# EAGLE design quantizer2_v50 (EAGLE 9.6.2)

## Sheet 1 of 2
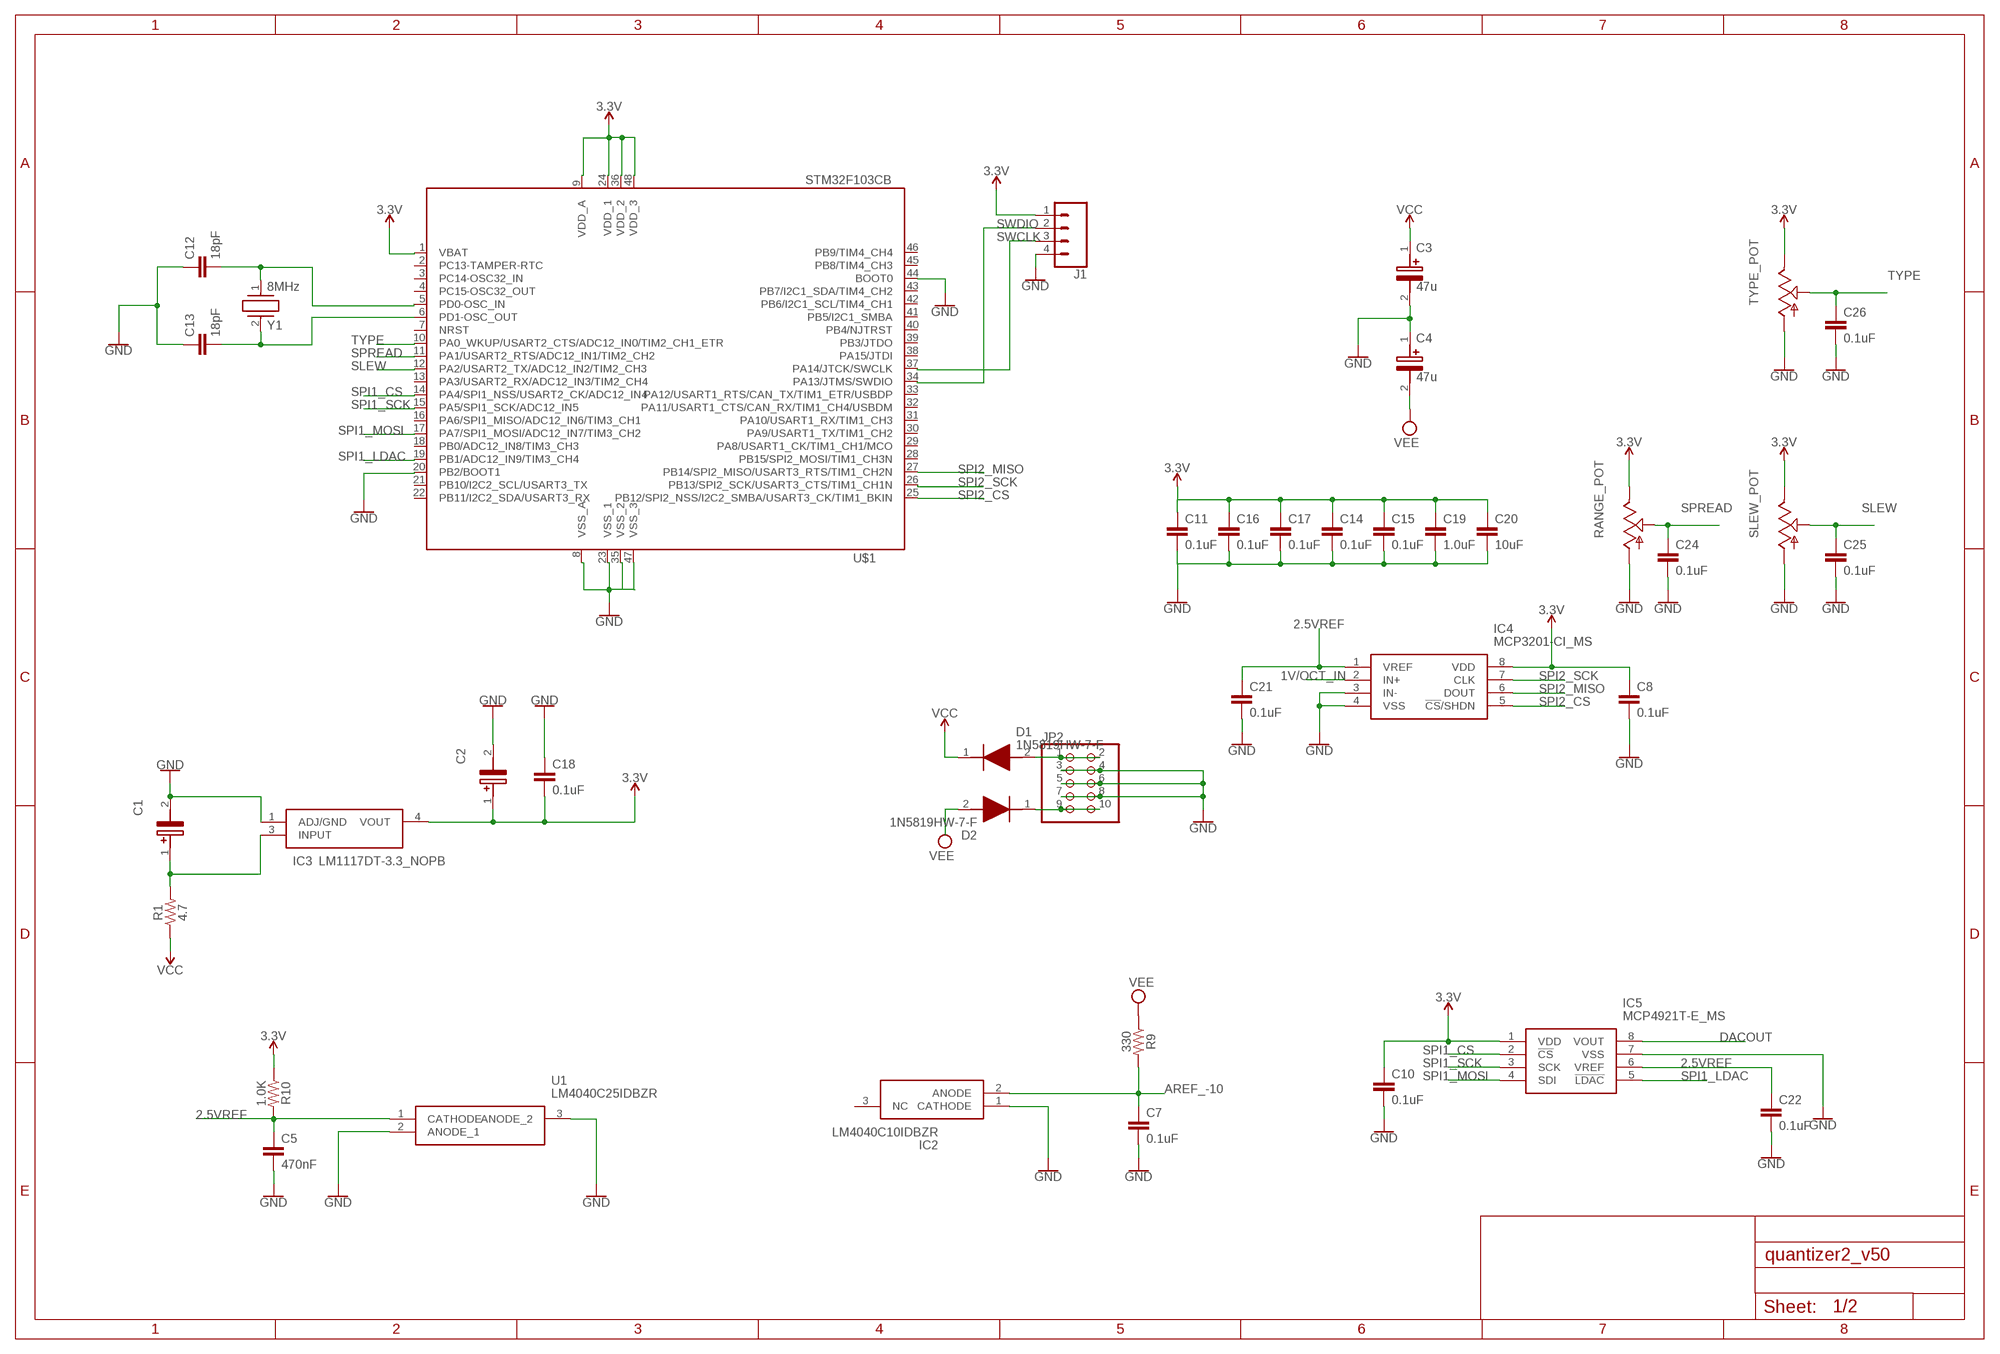
[diagram p0: schematic, sheet 1]

### Parts
C1  22uF  EEE-FP1E220AR  [EEE0GA101SR]
C2  22uF  EEE-FP1E220AR  [EEE0GA101SR]
C3  47u  EEE-FK1V470P  [EEE1AA101SP]
C4  47u  EEE-FK1V470P  [EEE1AA101SP]
C5  470nF  0.1UF-0603-25V-(+80/-20%)  [0603]
C7  0.1uF  0.1UF-0603-25V-(+80/-20%)  [0603]
C8  0.1uF  0.1UF-0603-25V-5%  [0603]
C10  0.1uF  0.1UF-0603-25V-5%  [0603]
C11  0.1uF  0.1UF-0603-25V-5%  [0603]
C12  18pF  18PF-0603-50V-5%  [0603]
C13  18pF  18PF-0603-50V-5%  [0603]
C14  0.1uF  0.1UF-0603-25V-5%  [0603]
C15  0.1uF  0.1UF-0603-25V-5%  [0603]
C16  0.1uF  0.1UF-0603-25V-(+80/-20%)  [0603]
C17  0.1uF  0.1UF-0603-25V-(+80/-20%)  [0603]
C18  0.1uF  0.1UF-0603-25V-(+80/-20%)  [0603]
C19  1.0uF  1.0UF-0603-16V-10%  [0603]
C20  10uF  10UF-0603-6.3V-20%  [0603]
C21  0.1uF  0.1UF-0603-25V-5%  [0603]
C22  0.1uF  0.1UF-0603-25V-5%  [0603]
C24  0.1uF  0.1UF-0603-25V-(+80/-20%)  [0603]
C25  0.1uF  0.1UF-0603-25V-(+80/-20%)  [0603]
C26  0.1uF  0.1UF-0603-25V-(+80/-20%)  [0603]
D1  1N5819HW-7-F  [SOD3716X145N]
D2  1N5819HW-7-F  [SOD3716X145N]
IC2  LM4040C10IDBZR  [SOT95P237X112-3N]
IC3  LM1117DT-3.3_NOPB  [TO228P991X238-3N]
IC4  MCP3201-CI_MS  [SOP65P490X110-8N]
IC5  MCP4921T-E_MS  [SOP65P490X110-8N]
J1  CONN_04  [1X04]
JP2  PINHD-2X5  [2X05]
R1  4.7  RESISTOR1206  [1206]
R9  330  RESISTOR0603  [0603]
R10  1.0K  RESISTOR0603  [0603]
RANGE_POT  POT_USVERTICAL_PS  [ALPS_POT_VERTICAL_PS]
SLEW_POT  POTENTIOMETER-ALPHA-9MM_VERTICAL_  [POTENTIOMETER-ALPHA-9MM_VERTICAL]
TYPE_POT  POT_USVERTICAL_PS  [ALPS_POT_VERTICAL_PS]
U1  LM4040C25IDBZR  [SOT95P237X112-3N]
U$1  STM32F103CB  [LQFP48]
Y1  8MHz  ABLS3-8.000MHZ-D4Y-T  [ABLS]

### Nets
1V/OCT_IN: IC4.2(IN+) ; also sheet 2
2.5VREF: C5.1 C21.1 C22.1 IC4.1(VREF) IC5.6(VREF) R10.2 U1.1(CATHODE)
3.3V: C2.1(+) C8.1 C10.1 C11.1 C14.1 C15.1 C16.1 C17.1 C18.2 C19.1 C20.1 IC3.4(VOUT) IC4.8(VDD) IC5.1(VDD) J1.1 R10.1 RANGE_POT.P$1(E) SLEW_POT.3(E) TYPE_POT.P$1(E) U$1.1(VBAT) U$1.9(VDD_A) U$1.24(VDD_1) U$1.36(VDD_2) U$1.48(VDD_3)
AREF_-10: C7.1 IC2.2(ANODE) R9.2 ; also sheet 2
DACOUT: IC5.8(VOUT) ; also sheet 2
GND: C1.2(-) C2.2(-) C3.2(-) C4.1(+) C5.2 C7.2 C8.2 C10.2 C12.1 C13.1 C18.1 C21.2 C22.2 C24.2 C25.2 C26.2 IC2.1(CATHODE) IC3.1(ADJ/GND) IC4.3(IN-) IC4.4(VSS) IC5.7(VSS) J1.4 JP2.3 JP2.4 JP2.5 JP2.6 JP2.7 JP2.8 RANGE_POT.P$3(A) SLEW_POT.1(A) TYPE_POT.P$3(A) U1.2(ANODE_1) U1.3(ANODE_2) U$1.8(VSS_A) U$1.20(PB2/BOOT1) U$1.23(VSS_1) U$1.35(VSS_2) U$1.44(BOOT0) U$1.47(VSS_3) ; also sheet 2
N$2: C1.1(+) IC3.3(INPUT) R1.2
N$4: D1.2(A) JP2.1 JP2.2
N$6: D2.1(K) JP2.9 JP2.10
N$10: C12.2 U$1.5(PD0-OSC_IN) Y1.1
N$11: C13.2 U$1.6(PD1-OSC_OUT) Y1.2
N$12: C11.2 C14.2 C15.2 C16.2 C17.2 C19.2 C20.2 ; supply symbol labelled GND
SLEW: C25.1 SLEW_POT.2(S) U$1.12(PA2/USART2_TX/ADC12_IN2/TIM2_CH3)
SPI1_CS: IC5.2(!CS) U$1.14(PA4/SPI1_NSS/USART2_CK/ADC12_IN4)
SPI1_LDAC: IC5.5(!LDAC) U$1.19(PB1/ADC12_IN9/TIM3_CH4)
SPI1_MOSI: IC5.4(SDI) U$1.17(PA7/SPI1_MOSI/ADC12_IN7/TIM3_CH2)
SPI1_SCK: IC5.3(SCK) U$1.15(PA5/SPI1_SCK/ADC12_IN5)
SPI2_CS: IC4.5(!CS!/SHDN) U$1.25(PB12/SPI2_NSS/I2C2_SMBA/USART3_CK/TIM1_BKIN)
SPI2_MISO: IC4.6(DOUT) U$1.27(PB14/SPI2_MISO/USART3_RTS/TIM1_CH2N)
SPI2_SCK: IC4.7(CLK) U$1.26(PB13/SPI2_SCK/USART3_CTS/TIM1_CH1N)
SPREAD: C24.1 RANGE_POT.P$2(S) U$1.11(PA1/USART2_RTS/ADC12_IN1/TIM2_CH2)
SWCLK: J1.3 U$1.37(PA14/JTCK/SWCLK)
SWDIO: J1.2 U$1.34(PA13/JTMS/SWDIO)
TYPE: C26.1 TYPE_POT.P$2(S) U$1.10(PA0_WKUP/USART2_CTS/ADC12_IN0/TIM2_CH1_ETR)
VCC: C3.1(+) D1.1(K) R1.1 ; also sheet 2
VEE: C4.2(-) D2.2(A) R9.1 ; also sheet 2
Unconnected: IC2.3(NC) U$1.2(PC13-TAMPER-RTC) U$1.3(PC14-OSC32_IN) U$1.4(PC15-OSC32_OUT) U$1.7(NRST) U$1.13(PA3/USART2_RX/ADC12_IN3/TIM2_CH4) U$1.16(PA6/SPI1_MISO/ADC12_IN6/TIM3_CH1) U$1.18(PB0/ADC12_IN8/TIM3_CH3) U$1.21(PB10/I2C2_SCL/USART3_TX) U$1.22(PB11/I2C2_SDA/USART3_RX) U$1.28(PB15/SPI2_MOSI/TIM1_CH3N) U$1.29(PA8/USART1_CK/TIM1_CH1/MCO) U$1.30(PA9/USART1_TX/TIM1_CH2) U$1.31(PA10/USART1_RX/TIM1_CH3) U$1.32(PA11/USART1_CTS/CAN_RX/TIM1_CH4/USBDM) U$1.33(PA12/USART1_RTS/CAN_TX/TIM1_ETR/USBDP) U$1.38(PA15/JTDI) U$1.39(PB3/JTDO) U$1.40(PB4/NJTRST) U$1.41(PB5/I2C1_SMBA) U$1.42(PB6/I2C1_SCL/TIM4_CH1) U$1.43(PB7/I2C1_SDA/TIM4_CH2) U$1.45(PB8/TIM4_CH3) U$1.46(PB9/TIM4_CH4)

## Sheet 2 of 2
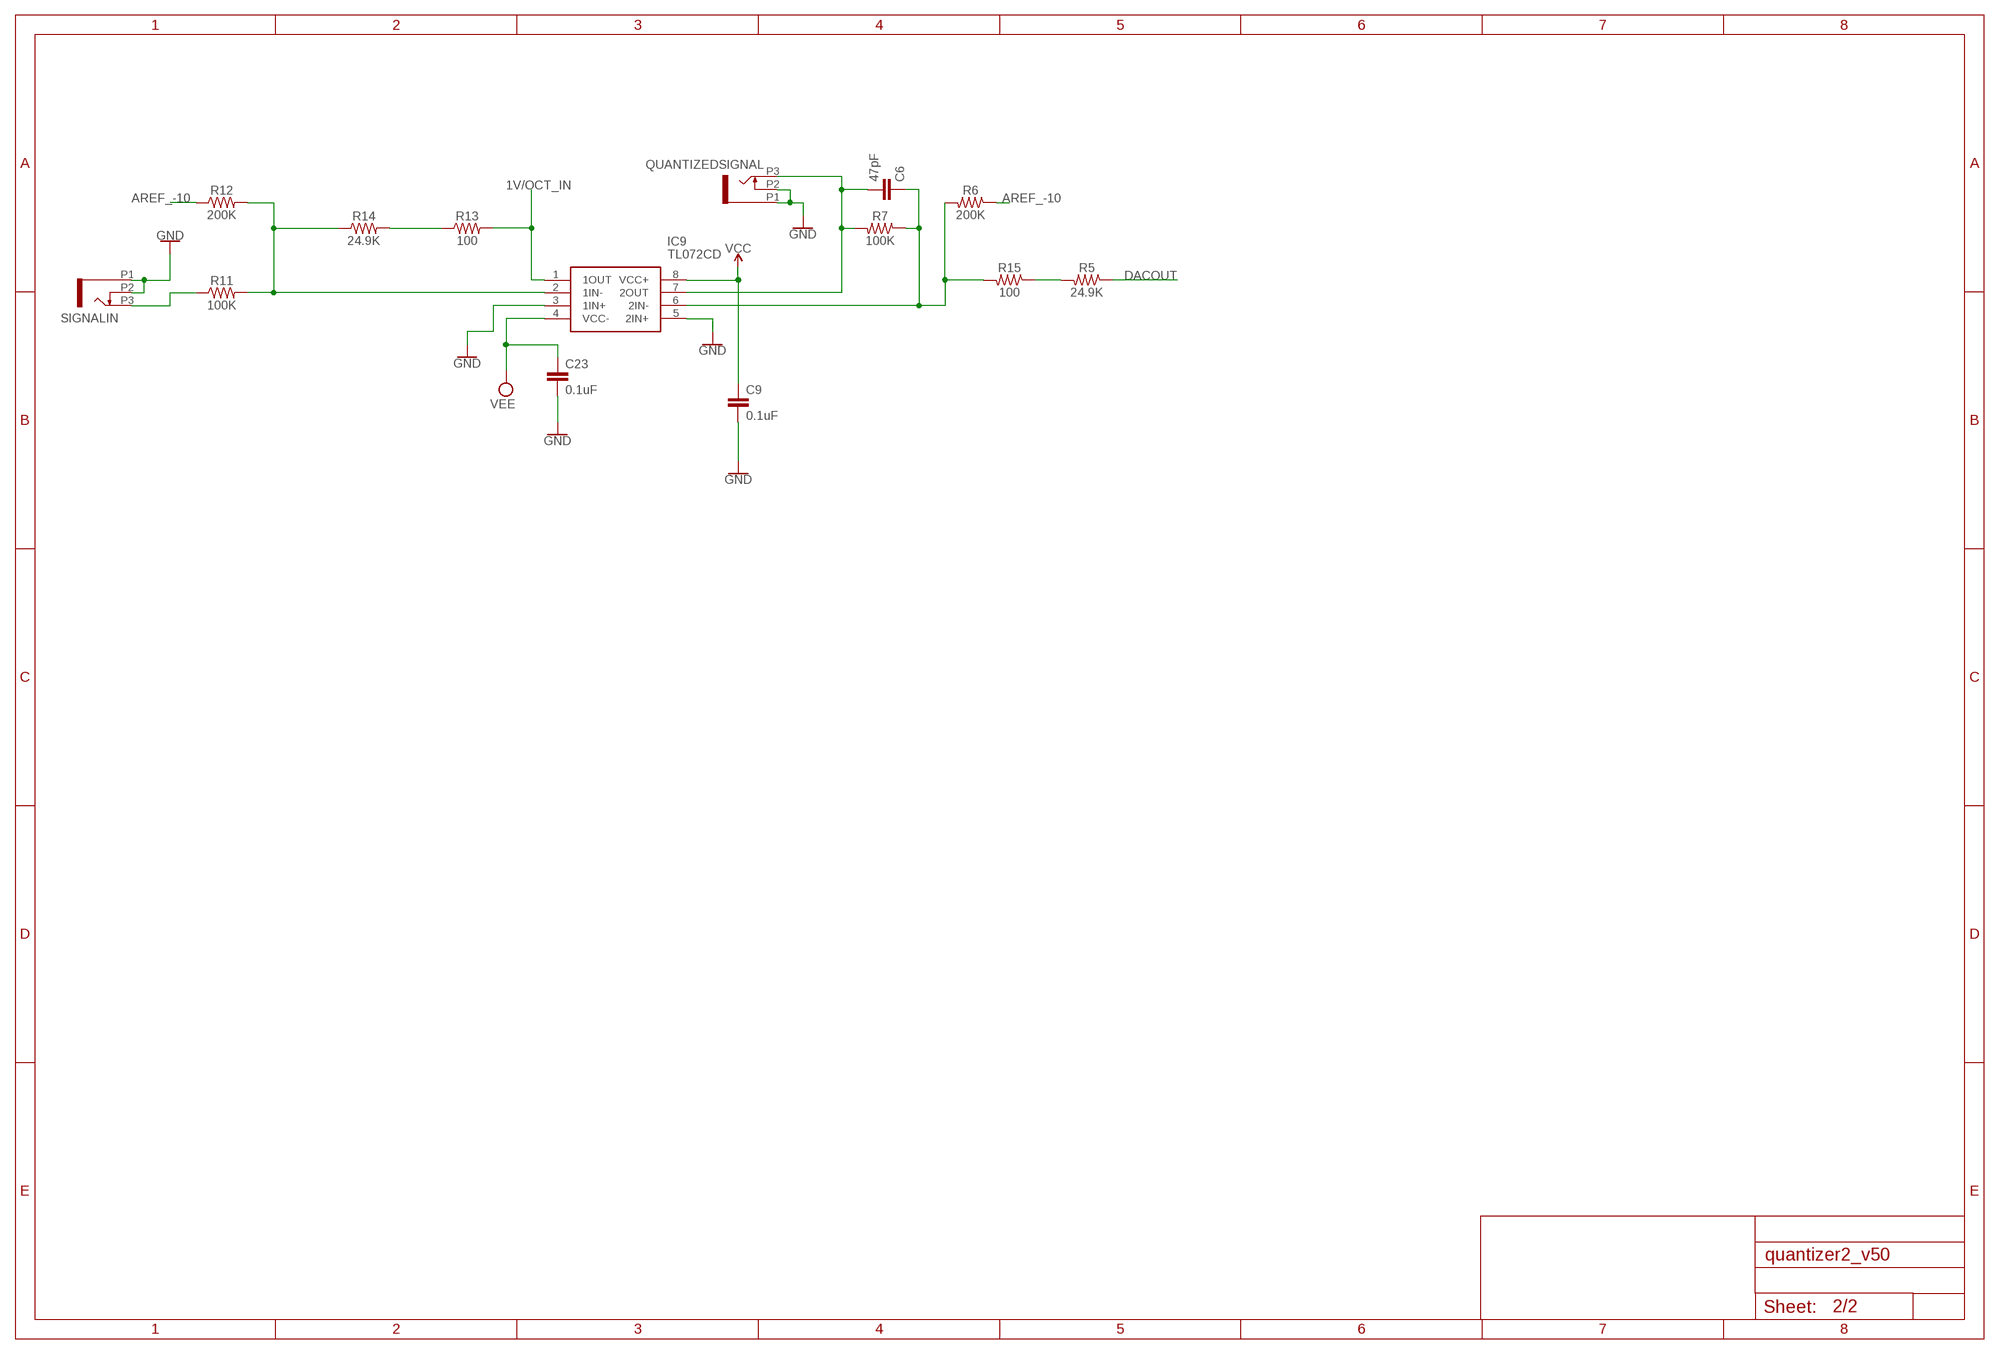
[diagram p1: schematic, sheet 2]

### Parts
C6  47pF  0.1UF-0603-25V-(+80/-20%)  [0603]
C9  0.1uF  0.1UF-0603-25V-(+80/-20%)  [0603]
C23  0.1uF  0.1UF-0603-25V-(+80/-20%)  [0603]
IC9  TL072CD  [SOIC127P600X175-8N]
QUANTIZEDSIGNAL  PJ301_THONKICONN6  [WQP_PJ_301M6]
R5  24.9K  RESISTOR0603  [0603]
R6  200K  RESISTOR0603  [0603]
R7  100K  RESISTOR0603  [0603]
R11  100K  RESISTOR0603  [0603]
R12  200K  RESISTOR0603  [0603]
R13  100  RESISTOR0603  [0603]
R14  24.9K  RESISTOR0603  [0603]
R15  100  RESISTOR0603  [0603]
SIGNALIN  PJ301_THONKICONN6  [WQP_PJ_301M6]

### Nets
1V/OCT_IN: IC9.1(1OUT) R13.2 ; also sheet 1
AREF_-10: R6.1 R12.1 ; also sheet 1
DACOUT: R5.1 ; also sheet 1
GND: C9.2 C23.2 IC9.3(1IN+) IC9.5(2IN+) QUANTIZEDSIGNAL.P1 QUANTIZEDSIGNAL.P2 SIGNALIN.P1 SIGNALIN.P2 ; also sheet 1
N$5: R11.1 SIGNALIN.P3
N$8: IC9.2(1IN-) R11.2 R12.2 R14.1
N$13: C6.2 IC9.7(2OUT) QUANTIZEDSIGNAL.P3 R7.2
N$15: R13.1 R14.2
N$16: R5.2 R15.1
N$17: C6.1 IC9.6(2IN-) R6.2 R7.1 R15.2
VCC: C9.1 IC9.8(VCC+) ; also sheet 1
VEE: C23.1 IC9.4(VCC-) ; also sheet 1

## Library data of the parts
C1 C2 = EEE-FP1E220AR:EEE-FP1E220AR: PANASONIC - EEEFP1E220AR - SMD Aluminium Electrolytic Capacitor, Radial Can - SMD, 22 F, 25 V, 0.36 ohm, FP Series Source: Datasheet <http://industrial.panasonic.com/cdbs/www-data/pdf/RDE0000/ABA0000C1184.pdf>; DESCRIPTION: PANASONIC - EEEFP1E220AR - SMD Aluminium Electrolytic Capacitor, Radial Can - SMD, 22 F, 25 V, 0.36 ohm, FP Series; HEIGHT: 6.5mm; MANUFACTURER_NAME: Panasonic; MANUFACTURER_PART_NUMBER: EEE-FP1E220AR; MOUSER_PART_NUMBER: 667-EEE-FP1E220AR; MOUSER_PRICE-STOCK: https://www.mouser.co.uk/ProductDetail/Panasonic/EEE-FP1E220AR?qs=d1CqaRUMZD%252ByxlCLn0gmaw%3D%3D
C3 C4 = EEE-FK1V470P:EEE-FK1V470P: Aluminum Electrolytic Capacitors - SMD 47uF 35V Source: Datasheet <http://industrial.panasonic.com/cdbs/www-data/pdf/RDE0000/ABA0000C1181.pdf>; DESCRIPTION: Aluminum Electrolytic Capacitors - SMD 47uF 35V; HEIGHT: 7.8mm; MANUFACTURER_NAME: Panasonic; MANUFACTURER_PART_NUMBER: EEE-FK1V470P; MOUSER_PART_NUMBER: 667-EEE-FK1V470P; MOUSER_PRICE-STOCK: https://www.mouser.co.uk/ProductDetail/Panasonic/EEE-FK1V470P?qs=qE6bgDGEOCuVUX5CkiabHQ%3D%3D
C5 C6 = SparkFun-Capacitors:0.1UF: 0.1µF ceramic capacitors A capacitor is a passive two-terminal electrical component used to store electrical energy temporarily in an electric field.; PROD_ID: CAP-00810; VALUE: 0.1uF
C7 C9 C16-C18 C23-C26 = SparkFun-Capacitors:0.1UF: 0.1µF ceramic capacitors A capacitor is a passive two-terminal electrical component used to store electrical energy temporarily in an electric field.; PROD_ID: CAP-00810
C8 C10 C11 C14 C15 C21 C22 = SparkFun-Capacitors:0.1UF: 0.1µF ceramic capacitors A capacitor is a passive two-terminal electrical component used to store electrical energy temporarily in an electric field.; PROD_ID: CAP-08604
C12 C13 = SparkFun-Capacitors:18PF: 18pF ceramic capacitors A capacitor is a passive two-terminal electrical component used to store electrical energy temporarily in an electric field.; PROD_ID: CAP-08267
C19 = SparkFun-Capacitors:1.0UF: 1µF ceramic capacitors A capacitor is a passive two-terminal electrical component used to store electrical energy temporarily in an electric field.; PROD_ID: CAP-00868
C20 = SparkFun-Capacitors:10UF: 10.0µF ceramic capacitors A capacitor is a passive two-terminal electrical component used to store electrical energy temporarily in an electric field.; PROD_ID: CAP-11015
D1 D2 = 1N5819HW-7-F:1N5819HW-7-F: Diode Schottky 1A 40V SOD123 Diodes Inc 1N5819HW-7-F, SMT Schottky Diode, 40V 1A, 2-Pin SOD-123 Source: Datasheet <https://datasheet.datasheetarchive.com/originals/distributors/Datasheets-DGA23/1390892.pdf>; DESCRIPTION: Diode Schottky 1A 40V SOD123 Diodes Inc 1N5819HW-7-F, SMT Schottky Diode, 40V 1A, 2-Pin SOD-123; HEIGHT: 1.45mm; MANUFACTURER_NAME: Diodes Inc.; MANUFACTURER_PART_NUMBER: 1N5819HW-7-F; MOUSER_PART_NUMBER: 621-1N5819HW-F; MOUSER_PRICE-STOCK: https://www.mouser.co.uk/ProductDetail/Diodes-Incorporated/1N5819HW-7-F?qs=NQ47qNm99eDyWTEd07miYA%3D%3D
IC2 = LM4040C10IDBZR:LM4040C10IDBZR: PRECISION MICROPOWER SHUNT VOLTAGE REFERENCE Source: Datasheet <http://www.ti.com/lit/gpn/lm4040>; DESCRIPTION: PRECISION MICROPOWER SHUNT VOLTAGE REFERENCE; HEIGHT: mm; MANUFACTURER_NAME: Texas Instruments; MANUFACTURER_PART_NUMBER: LM4040C10IDBZR; MOUSER_PART_NUMBER: 595-LM4040C10IDBZR; MOUSER_PRICE-STOCK: https://www.mouser.com/Search/Refine.aspx?Keyword=595-LM4040C10IDBZR
IC3 = LM1117DT-3.3_NOPB:LM1117DT-3.3_NOPB: Space saving 800-mA low-dropout linear regulator with internal current limit Source: Datasheet <https://datasheet.datasheetarchive.com/originals/distributors/Datasheets-SFU2/DSASFU100036103.pdf>; DESCRIPTION: Space saving 800-mA low-dropout linear regulator with internal current limit; HEIGHT: 2.38mm; MANUFACTURER_NAME: Texas Instruments; MANUFACTURER_PART_NUMBER: LM1117DT-3.3/NOPB; MOUSER_PART_NUMBER: 926-LM1117DT-3.3NOPB; MOUSER_PRICE-STOCK: https://www.mouser.co.uk/ProductDetail/Texas-Instruments/LM1117DT-3.3-NOPB?qs=X1J7HmVL2ZHOT670myqy2w%3D%3D
IC4 = MCP3201-CI_MS:MCP3201-CI_MS: Analog to Digital Converters - ADC 12-bit SPI Sgl Chl Source: Datasheet <http://www.microchip.com/mymicrochip/filehandler.aspx?ddocname=en011279>; DESCRIPTION: Analog to Digital Converters - ADC 12-bit SPI Sgl Chl; HEIGHT: 1.1mm; MANUFACTURER_NAME: Microchip; MANUFACTURER_PART_NUMBER: MCP3201-CI/MS; MOUSER_PART_NUMBER: 579-MCP3201-CI/MS; MOUSER_PRICE-STOCK: https://www.mouser.co.uk/ProductDetail/Microchip-Technology-Atmel/MCP3201-CI-MS?qs=mcPJWgAPNrdThuaOU%2FBAFA%3D%3D
IC5 = MCP4921T-E_MS:MCP4921T-E_MS: Digital to Analog Converters - DAC Sgl 12-bit SPI int Source: Datasheet <http://www.microchip.com/mymicrochip/filehandler.aspx?ddocname=en547911>; DESCRIPTION: Digital to Analog Converters - DAC Sgl 12-bit SPI int; HEIGHT: 1.1mm; MANUFACTURER_NAME: Microchip; MANUFACTURER_PART_NUMBER: MCP4921T-E/MS; MOUSER_PART_NUMBER: 579-MCP4921T-E/MS; MOUSER_PRICE-STOCK: https://www.mouser.co.uk/ProductDetail/Microchip-Technology/MCP4921T-E-MS?qs=fM4xO01eazMZI7WjXZqD2A%3D%3D
IC9 = TL072CD:TL072CD: Dual Low-Noise JFET-Input General-Purpose Operational Amplifier Source: Datasheet <http://www.ti.com/lit/ds/symlink/tl072.pdf>; DESCRIPTION: Dual Low-Noise JFET-Input General-Purpose Operational Amplifier; HEIGHT: 1.75mm; MANUFACTURER_NAME: Texas Instruments; MANUFACTURER_PART_NUMBER: TL072CD; MOUSER_PART_NUMBER: 595-TL072CD; MOUSER_PRICE-STOCK: https://www.mouser.co.uk/ProductDetail/Texas-Instruments/TL072CD?qs=5nGYs9Do7G0niDPig1J2Tw%3D%3D
J1 = SparkFun-Connectors:CONN_04: Multi connection point. Often used as Generic Header-pin footprint for 0.1 inch spaced/style header connections On any of the 0.1 inch spaced packages, you can populate with these: Break Away Headers - Straight <https://www.sparkfun.com/products/116> (PRT-00116) Break Away Male Headers - Right Angle <https://www.sparkfun.com/products/553> (PRT-00553) Female Headers <https://www.sparkfun.com/products/115> (PRT-00115) Break Away Headers - Machine Pin <https://www.sparkfun.com/products/117> (PRT-00117) Break Away Female Headers - Swiss Machine Pin <https://www.sparkfun.com/products/743> (PRT-00743) For SCREWTERMINALS and SPRING TERMINALS visit here: Screw Terimnals on SparkFun.com <https://www.sparkfun.com/search/results?term=Screw+Terminals> (5mm/3.5mm/2.54mm spacing) This device is also useful as a general connection point to wire up your design to another part of your project. Our various solder wires solder well into these plated through hole pads. Hook-Up Wire - Assortment (Stranded, 22 AWG) <https://www.sparkfun.com/products/11375> (PRT-11375) Hook-Up Wire - Assortment (Solid Core, 22 AWG) <https://www.sparkfun.com/products/11367> (PRT-11367) View the entire wire category on our website here <https://www.sparkfun.com/categories/141> Special notes: Molex polarized connector foot print use with SKU : PRT-08231 with associated crimp pins and housings. 1MM SMD Version SKU: PRT-10208; PROD_ID: CONN-09696
JP2 = pinhead:PINHD-2X5: PIN HEADER
QUANTIZEDSIGNAL SIGNALIN = og-pj301_variations:PJ301_THONKICONN
R1 R5-R7 R9-R15 = SparkFun-Resistors:RESISTOR: Generic Resistor Package
RANGE_POT TYPE_POT = og-pots:POT_US
SLEW_POT = EURACK-MASTER-LIB:POTENTIOMETER-ALPHA-9MM_VERTICAL: 9mm vertical snap-in pot, Alpha / Panasonic style
U1 = LM4040C25IDBZR:LM4040C25IDBZR: TEXAS INSTRUMENTS - LM4040C25IDBZR - VOLTAGE REF, SHUNT, 2.5V, SOT-23-3 Source: Datasheet <https://datasheet.datasheetarchive.com/originals/distributors/Datasheets-DGA16/867624.pdf>; DESCRIPTION: TEXAS INSTRUMENTS - LM4040C25IDBZR - VOLTAGE REF, SHUNT, 2.5V, SOT-23-3; HEIGHT: 1.12mm; MANUFACTURER_NAME: Texas Instruments; MANUFACTURER_PART_NUMBER: LM4040C25IDBZR; MOUSER_PART_NUMBER: 595-LM4040C25IDBZR; MOUSER_PRICE-STOCK: https://www.mouser.co.uk/ProductDetail/Texas-Instruments/LM4040C25IDBZR?qs=VBduBm9rCJStNYDGENjZXg%3D%3D
U$1 = stm32:STM32F103CB
Y1 = ABLS3-8.000MHZ-D4Y-T:ABLS3-8.000MHZ-D4Y-T: HC49/US (AT49) LOW PROFILE SMD MICROPROCESSOR CRYSTAL Source: Datasheet <https://abracon.com/Resonators/abls.pdf>; DESCRIPTION: HC49/US (AT49) LOW PROFILE SMD MICROPROCESSOR CRYSTAL; HEIGHT: mm; MANUFACTURER_NAME: ABRACON; MANUFACTURER_PART_NUMBER: ABLS3-8.000MHZ-D4Y-T; MOUSER_PART_NUMBER: 815-ABLS3-8MD4YT; MOUSER_PRICE-STOCK: https://www.mouser.co.uk/ProductDetail/ABRACON/ABLS3-8000MHZ-D4Y-T?qs=WRzgYYgs9gC3im7pazpFGA%3D%3D

## Board
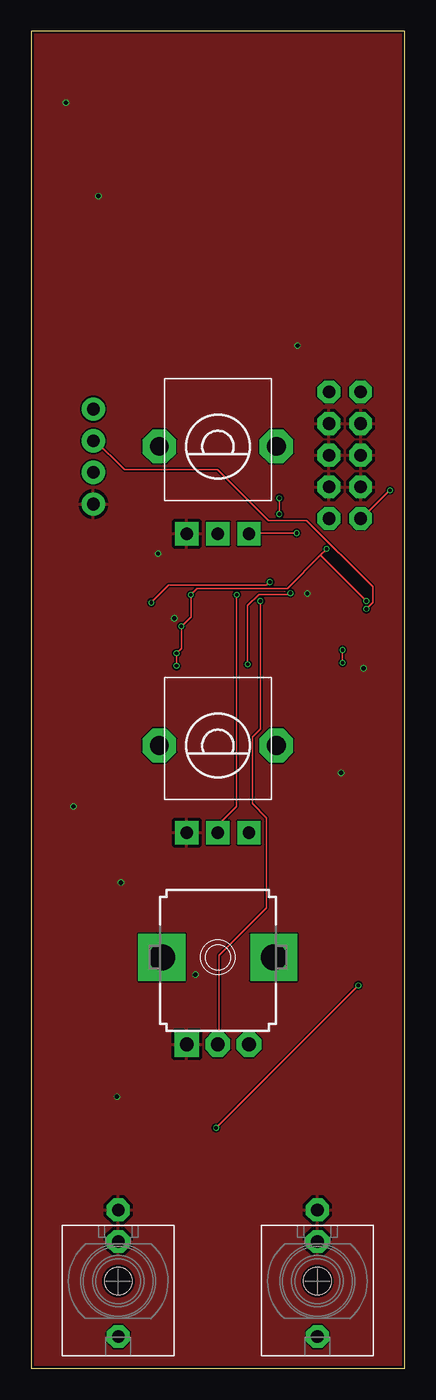
[diagram p2: board, top side]
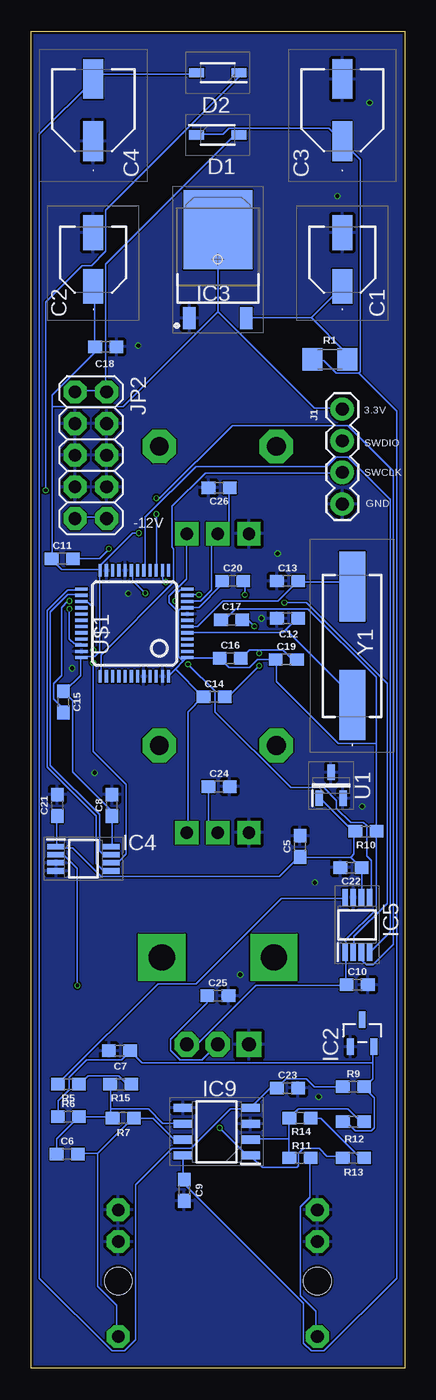
[diagram p3: board, bottom side, seen from below]

Size 30 x 107.34 mm. Coordinates in mm from the lower left corner, seen from the top.
Outline: 0,0 30,0 30,107.34 0,107.34 0,0
Copper layers (1*16): Top 0.035mm / dielectric 1.6mm / Bottom 0.035mm
Design rules "jlcpcb-2layers": minimum track width 5mil, minimum drill 0.3mm, track to track 5mil, track to pad 5mil, pad to pad 5mil, via to via 5mil, smd to smd 5mil, copper to edge 0.2mm, drill to drill 6mil, minimum pad ring 10mil, minimum via ring 3mil, stop-mask expansion 4mil, vias tented up to drill 0mil, thermal gap 10mil

### Footprints (pad centres in the part's own frame; a part is rotated, then mirrored left to right if it is on the bottom)
EEE0GA101SR = smd 2.8 x 1.6: 1 -2.15,0; 2 2.15,0
EEE1AA101SP = smd 3.2 x 1.6: 1 -2.5,0; 2 2.5,0
0603 = smd 1.1 x 1: 1 -0.85,0; 2 0.85,0
SOD3716X145N = smd 1.2 x 0.75: 1 -1.7,0; 2 1.7,0
SOT95P237X112-3N = smd 1.321 x 0.559: 1 -1.092,0.94; 2 -1.092,-0.94 | smd 1.321 x 0.508: 3 1.092,0
TO228P991X238-3N = smd 1.75 x 1: 1 -4.7,2.285; 3 -4.7,-2.285 | smd 6.35 x 5.55: 4 2.4,0
SOP65P490X110-8N = smd 1.4 x 0.45: 1 -2.2,0.975; 2 -2.2,0.325; 3 -2.2,-0.325; 4 -2.2,-0.975; 5 2.2,-0.975; 6 2.2,-0.325; 7 2.2,0.325; 8 2.2,0.975
SOIC127P600X175-8N = smd 1.528 x 0.65: 1 -2.711,1.905; 2 -2.711,0.635; 3 -2.711,-0.635; 4 -2.711,-1.905; 5 2.711,-1.905; 6 2.711,-0.635; 7 2.711,0.635; 8 2.711,1.905
1X04 = drill 1.016 pad 1.88: 1 0,0; 2 2.54,0; 3 5.08,0; 4 7.62,0
2X05 = drill 1.016 octagon: 1 -5.08,-1.27; 2 -5.08,1.27; 3 -2.54,-1.27; 4 -2.54,1.27; 5 0,-1.27; 6 0,1.27; 7 2.54,-1.27; 8 2.54,1.27; 9 5.08,-1.27; 10 5.08,1.27
WQP_PJ_301M6 = drill 1.016 pad 1.778 octagon: P1 0,-5.715; P2 0,-3.175; P3 0,4.445 | hole 2.2: 0,0
1206 = smd 1.6 x 1.8: 1 -1.4,0; 2 1.4,0
ALPS_POT_VERTICAL_PS = drill 1 pad 1.88 square: P$1 -2.5,7; P$2 0,7; P$3 2.5,7 | drill 1.5 pad 2.54 octagon: P$4 -4.7,0; P$5 4.7,0
POTENTIOMETER-ALPHA-9MM_VERTICAL = drill 1.1 pad 1.676 square: 1 -2.5,-7 | drill 1.1 pad 1.676 octagon: 2 0,-7; 3 2.5,-7 | drill 2.1 pad 2.8 square: M1 4.5,0; M2 -4.5,0
SOT95P237X112-3N' = smd 1.25 x 0.6: 1 -1.05,0.95; 2 -1.05,-0.95; 3 1.05,0
LQFP48 = smd 0.254 x 1: 1 -2.75,-4.25; 2 -2.25,-4.25; 3 -1.75,-4.25; 4 -1.25,-4.25; 5 -0.75,-4.25; 6 -0.25,-4.25; 7 0.25,-4.25; 8 0.75,-4.25; 9 1.25,-4.25; 10 1.75,-4.25; 11 2.25,-4.25; 12 2.75,-4.25; 25 2.75,4.25; 26 2.25,4.25; 27 1.75,4.25; 28 1.25,4.25; 29 0.75,4.25; 30 0.25,4.25; 31 -0.25,4.25; 32 -0.75,4.25; 33 -1.25,4.25; 34 -1.75,4.25; 35 -2.25,4.25; 36 -2.75,4.25 | smd 1 x 0.254: 13 4.25,-2.75; 14 4.25,-2.25; 15 4.25,-1.75; 16 4.25,-1.25; 17 4.25,-0.75; 18 4.25,-0.25; 19 4.25,0.25; 20 4.25,0.75; 21 4.25,1.25; 22 4.25,1.75; 23 4.25,2.25; 24 4.25,2.75; 37 -4.25,2.75; 38 -4.25,2.25; 39 -4.25,1.75; 40 -4.25,1.25; 41 -4.25,0.75; 42 -4.25,0.25; 43 -4.25,-0.25; 44 -4.25,-0.75; 45 -4.25,-1.25; 46 -4.25,-1.75; 47 -4.25,-2.25; 48 -4.25,-2.75
ABLS = smd 5.6 x 2.1: 1 -4.75,0; 2 4.75,0

### Placement (x,y rotation side)
C1  5,89 90 bottom
C2  25,89 90 bottom
C3  5,101 90 bottom
C4  25,101 90 bottom
C5  8.4,41.9 90 bottom
C6  27.1,17.2 0 bottom
C7  22.9,25.5 180 bottom
C8  23.5,45.2 90 bottom
C9  17.7,14.3 270 bottom
C10  3.8,30.8 0 bottom
C11  27.5,65 0 bottom
C12  9.4,60.2 0 bottom
C13  9.4,63.2 0 bottom
C14  15.3,53.9 0 bottom
C15  27.4,53.5 270 bottom
C16  14,57 0 bottom
C17  13.9,60.1 0 bottom
C18  24,82 180 bottom
C19  9.5,56.9 0 bottom
C20  13.8,63.2 0 bottom
C21  27.9,45.2 90 bottom
C22  4.3,40.2 180 bottom
C23  9.4,22.5 0 bottom
C24  14.9,46.7 0 bottom
C25  15,29.9 0 bottom
C26  14.9,70.7 180 bottom
D1  15,99 0 bottom
D2  15,104 180 bottom
IC2  3.4,26.9 90 bottom
IC3  15,89 90 bottom
IC4  25.8,40.9 0 bottom
IC5  3.8,35.6 90 bottom
IC9  15.1,19 180 bottom
J1  5,77 270 bottom
JP2  25.2,73.3 270 bottom
QUANTIZEDSIGNAL  23,7 180 top
R1  6,81 0 bottom
R5  27,22.8 0 bottom
R6  27,20.2 0 bottom
R7  22.6,20.1 0 bottom
R9  4.1,22.6 0 bottom
R10  3.1,43.1 180 bottom
R11  8.4,16.9 180 bottom
R12  4.1,19.8 0 bottom
R13  4.1,16.9 180 bottom
R14  8.4,20.1 0 bottom
R15  22.8,22.8 180 bottom
RANGE_POT  15,50 180 top
SIGNALIN  7,7 180 top
SLEW_POT  15,33 0 top
TYPE_POT  15,74 180 top
U1  LM4040C25IDBZR  [SOT95P237X112-3N']  5.9,46.8 90 bottom
U$1  21.7,59.8 90 bottom
Y1  4.2,58 90 bottom

### Tracks (layer width: path | path; a pad name or v marks a point on that pad's centre or on a via)
1V/OCT_IN  (via drill 0.3)
  Top 0.127: v14.86,19.3 v26.29,30.73
  Bottom 0.127: R13.2 4.95,17.02 6.22,17.02 6.86,17.65 8.13,17.65 8.51,17.27 8.51,16.26 8.64,16.13 11.43,16.13 12.32,17.02 IC9.1 12.45,17.14 12.7,17.14 v14.86,19.3 | v26.29,30.73 26.29,40.13 27.3,41.15 27.94,41.15 IC4.2
2.5VREF
  Bottom 0.127: C21.1 27.94,44.32 27.94,41.91 IC4.1 27.94,41.78 26.67,41.78 24.38,39.5 10.03,39.5 8.51,41.02 C5.1 8.38,41.02 4.32,41.02 | IC5.6 3.43,37.85 3.43,40.13 C22.1 3.56,40.26 4.32,41.02 | 4.06,43.05 4.06,41.27 4.32,41.02 | 4.06,43.05 6.73,45.72 U1.1 | 4.06,43.05 R10.2
3.3V  (via drill 0.3)
  Top 0.127: v21.34,67.06 17.53,67.06 TYPE_POT.P$1
  Bottom 0.127: C20.1 14.73,63.12 14.73,62.87 16.51,61.09 17.4,61.09 U$1.9 17.53,60.96 18.03,60.96 18.16,60.83 18.16,60.71 | 17.78,56.77 17.53,57.02 U$1.1 17.4,57.02 14.86,57.02 C16.1 14.73,56.9 14.1,56.26 12.45,56.26 11.81,56.9 10.41,56.9 C19.1 10.29,56.9 10.29,55.12 5.33,50.16 2.29,50.16 | 17.78,56.77 18.41,56.13 | 18.41,56.13 18.92,55.63 U$1.48 | 18.41,56.13 16.26,53.98 C14.1 16.26,53.85 17.4,52.7 17.4,43.05 RANGE_POT.P$1 | 18.16,60.71 18.16,57.15 17.78,56.77 | 18.16,60.71 18.92,61.47 18.92,61.98 17.53,63.37 17.53,66.93 TYPE_POT.P$1 | 2.29,50.16 2.29,43.18 R10.1 2.29,43.05 2.29,36.83 4.7,34.42 4.7,33.4 IC5.1 4.7,33.27 4.7,30.86 C10.1 4.7,30.73 11.94,30.73 16.64,26.04 17.4,26.04 SLEW_POT.3 | 2.29,50.16 2.29,55.5 7.75,60.96 13.59,60.96 14.35,60.2 14.73,60.2 C17.1 | 14.99,84.84 7.24,77.09 5.08,77.09 J1.1 | 14.99,84.84 14.99,91.31 IC3.4 | C2.1 24.89,86.74 24.89,82.04 C18.2 24.89,81.92 24.89,81.53 28.32,78.11 28.32,77.22 | U$1.24 24.51,64.14 27.56,64.14 28.32,64.9 C11.1 28.32,65.02 28.32,77.22 | IC4.8 23.5,41.91 23.5,44.32 C8.1 23.62,44.45 23.62,44.83 26.67,47.88 26.67,53.59 27.3,54.23 C15.1 27.3,54.36 26.04,55.63 26.04,57.02 U$1.36 25.91,57.15 24.89,57.15 24.51,57.53 24.51,64.01 U$1.24 | 14.99,84.84 22.61,77.22 28.32,77.22 | v21.34,67.06 21.84,67.06 24.38,64.52 24.38,64.14 U$1.24
AREF_-10
  Bottom 0.127: R12.1 4.83,19.68 4.57,19.68 3.94,19.05 2.67,19.05 2.41,19.3 2.41,21.72 3.17,22.48 R9.2 3.17,22.61 2.54,23.24 2.54,24.51 | 2.54,24.51 2.54,25.78 IC2.2 | R6.1 27.81,20.32 27.81,21.46 26.92,22.35 26.92,23.37 25.53,24.77 22.73,24.77 22.1,25.4 C7.1 21.97,25.4 21.08,24.51 2.54,24.51
DACOUT
  Bottom 0.127: R5.1 27.81,22.86 19.81,30.86 16.76,30.86 9.91,37.72 4.83,37.72 IC5.8
GND  (via drill 0.35)
  other vias: 2.8,101.6 10.2,65.4 11.5,60.2 3.4,45.1 7.2,39 13.2,31.6 6.9,21.8 24.9,47.8 26.7,56.2 22.2,62.2 21.4,82.1 5.4,94.1
  pour Top: 0,107.3 30,107.3 30,0 0,0
  pour Bottom: 0,107.3 30,107.3 30,0 0,0
N$2
  Bottom 0.127: 7.49,84.33 12.7,84.33 IC3.3 | 7.49,84.33 5.08,86.74 C1.1 | 7.49,84.33 4.7,81.53 4.7,81.03 R1.2
N$4
  Bottom 0.127: 24,78.49 24,88.65 13.72,98.93 13.34,98.93 D1.2 | 24,78.49 26.42,78.49 JP2.1 | 24,78.49 JP2.2
N$5
  Bottom 0.127: R11.1 7.62,16.89 7.62,13.72 8.38,12.95 8.38,5.84 7.11,4.57 7.11,2.67 SIGNALIN.P3
N$6  (via drill 0.3)
  Top 0.127: v28.83,70.48 26.54,68.2 JP2.9
  Bottom 0.127: v28.83,70.48 28.83,85.6 25.91,88.52 25.15,88.52 24,89.66 24,92.96 13.34,103.63 13.34,103.89 D2.1 | JP2.10 24,68.33 26.42,68.33 JP2.9
N$8
  Bottom 0.127: R12.2 3.3,19.81 3.56,19.81 4.57,20.83 8.51,20.83 9.14,20.19 R14.1 9.27,20.07 9.27,18.41 | 9.27,18.41 9.27,17.02 R11.2 | 9.27,18.41 12.32,18.41 IC9.2
N$10
  Bottom 0.127: 9.53,59.31 8.64,60.2 C12.2 | 9.53,59.31 9.78,59.05 17.4,59.05 U$1.5 | 9.53,59.31 4.32,54.1 4.32,53.34 Y1.1
N$11
  Bottom 0.127: U$1.6 17.4,59.56 16.64,59.56 14.61,61.59 10.16,61.59 8.64,63.12 C13.2 8.51,63.12 4.57,63.12 4.32,62.87 Y1.2
N$12  (via drill 0.3)
  Top 0.127: v11.68,56.39 v11.68,57.4 12.06,57.78 v12.06,59.56 12.83,60.33 v12.83,62.1 13.34,62.61 20.57,62.61 23.24,65.28 | 23.24,65.28 v23.75,65.79 | 23.24,65.28 v26.92,61.59
  Bottom 0.127: 11.68,57.66 12.45,57.66 13.08,57.02 C16.2 | 11.68,57.66 9.78,57.66 9.14,57.02 8.76,57.02 C19.2 | v11.68,56.39 14.1,53.98 14.35,53.98 C14.2 | 11.68,57.66 v11.68,57.4 | v12.06,59.56 12.57,60.07 12.95,60.07 C17.2 | v12.83,62.1 12.83,63.12 C20.2 | v23.75,65.79 24.51,65.02 26.54,65.02 C11.2 | v26.92,61.59 27.05,61.59 27.56,61.09 27.56,55.63 28.19,54.99 28.19,53.72 27.43,52.96 27.43,52.7 C15.2
N$13
  Bottom 0.127: IC9.7 17.91,18.41 18.54,18.41 20.19,20.07 21.72,20.07 R7.2 21.84,20.07 24.64,17.27 | 24.64,17.27 26.16,17.27 C6.2 | 24.64,17.27 24.64,6.6 23.11,5.08 23.11,2.67 QUANTIZEDSIGNAL.P3
N$15
  Bottom 0.127: R13.1 3.3,17.02 3.68,17.02 6.73,20.07 7.49,20.07 R14.2
N$16
  Bottom 0.127: R15.1 21.97,22.86 22.35,22.86 22.99,23.5 25.4,23.5 26.04,22.86 R5.2
N$17
  Bottom 0.127: 23.62,20.19 26.04,20.19 R6.2 26.16,20.19 27.94,18.41 27.94,17.27 C6.1 | 23.62,20.19 23.5,20.19 R7.1 23.62,20.19 | 23.62,20.19 23.62,20.83 | 23.62,20.83 23.62,22.73 R15.2 | 23.62,20.83 20.57,20.83 19.43,19.68 17.91,19.68 IC9.6
SLEW  (via drill 0.3)
  Top 0.127: v18.41,61.59 18.41,51.31 17.78,50.67 17.78,45.34 18.92,44.2 18.92,36.96 15.11,33.15 15.11,26.04 SLEW_POT.2
  Bottom 0.127: v18.41,61.59 18.41,62.1 18.03,62.48 17.53,62.48 U$1.12 | C25.1 15.88,29.84 15.88,29.34 18.8,26.42 18.8,25.53 18.03,24.77 16.26,24.77 15.11,25.91 SLEW_POT.2
SPI1_CS  (via drill 0.3)
  Top 0.127: v19.18,63.12 18.92,62.87 11.05,62.87 v9.65,61.47
  Bottom 0.127: v19.18,63.12 19.43,63.37 19.43,64.01 U$1.14 | v9.65,61.47 7.87,61.47 1.4,54.99 1.4,37.34 4.06,34.67 4.06,33.4 IC5.2
SPI1_LDAC  (via drill 0.3)
  Top 0.127: v20.83,62.23 20.7,62.1 18.29,62.1 17.4,61.21 v17.4,56.52
  Bottom 0.127: v20.83,62.23 21.84,63.25 21.84,64.01 U$1.19 | v17.4,56.52 15.24,54.36 15.24,52.7 9.14,46.61 6.48,46.61 5.46,45.59 5.46,44.96 4.32,43.81 3.3,43.81 3.05,43.56 3.05,41.15 2.67,40.77 2.67,37.97 2.79,37.85 IC5.5
SPI1_MOSI
  Bottom 0.127: U$1.17 20.83,64.14 20.83,68.33 16.76,72.39 6.22,72.39 5.46,73.15 4.57,73.15 1.14,69.72 1.14,35.05 2.79,33.4 IC5.4
SPI1_SCK  (via drill 0.3)
  Top 0.127: v19.94,69.85 v19.94,68.58
  Bottom 0.127: v19.94,68.58 19.94,64.14 U$1.15 | v19.94,69.85 19.68,69.85 13.84,75.69 4.57,75.69 0.89,72.01 0.89,34.04 2.54,32.38 3.05,32.38 3.43,32.77 3.43,33.27 IC5.3
SPI2_CS
  Bottom 0.127: U$1.25 26.04,62.48 27.05,62.48 28.7,60.83 28.7,48.26 24.77,44.32 24.77,40.51 24.26,40.01 23.62,40.01 IC4.5
SPI2_MISO  (via drill 0.3)
  Top 0.127: v25.02,56.64 v25.02,57.66
  Bottom 0.127: v25.02,57.66 25.02,61.09 25.4,61.47 25.91,61.47 U$1.27 | v25.02,56.64 25.02,49.53 22.35,46.86 22.35,41.27 22.99,40.64 23.5,40.64 IC4.6
SPI2_SCK
  Bottom 0.127: U$1.26 26.04,62.1 27.05,62.1 28.45,60.71 28.45,48.39 24.51,44.45 24.51,41.53 24.26,41.27 23.62,41.27 IC4.7
SPREAD  (via drill 0.3)
  Top 0.127: v16.51,62.1 16.51,45.09 15.11,43.69 15.11,43.05 RANGE_POT.P$2
  Bottom 0.127: v16.51,62.1 17.4,62.1 U$1.11 | C24.1 15.75,46.61 15.75,43.69 15.11,43.05 RANGE_POT.P$2
SWCLK
  Bottom 0.127: U$1.37 24.38,55.63 24.38,57.28 18.54,63.12 18.54,65.79 18.67,65.91 18.67,69.22 16,71.88 5.08,71.88 J1.3
SWDIO  (via drill 0.3)
  Top 0.127: v26.92,60.96 27.43,61.47 27.43,62.74 22.1,68.07 19.05,68.07 14.99,72.14 7.49,72.14 5.08,74.55 J1.2
  Bottom 0.127: v26.92,60.96 26.92,58.55 26.54,58.17 26.04,58.17 U$1.34
TYPE
  Bottom 0.127: U$1.10 17.4,61.59 16.38,61.59 15.49,62.48 15.49,66.55 15.11,66.93 TYPE_POT.P$2 14.99,67.06 14.1,67.94 14.1,70.61 C26.1
VCC
  Bottom 0.127: IC9.8 17.78,17.02 17.78,15.24 C9.1 17.65,15.11 17.65,14.73 8.13,5.21 8.13,2.03 7.49,1.4 6.48,1.4 0.64,7.24 0.64,76.83 3.68,79.88 | D1.1 16.64,99.06 14.61,99.06 14.1,99.57 6.1,99.57 5.08,98.55 C3.1 4.95,98.42 3.56,97.03 3.56,80.01 3.68,79.88 | 3.68,79.88 5.46,79.88 6.48,80.9 7.37,80.9 R1.1
VEE
  Bottom 0.127: R9.1 7.24,22.61 7.87,23.24 9.53,23.24 10.16,22.61 C23.1 10.29,22.48 10.79,22.48 12.32,20.95 IC9.4 12.45,20.83 13.97,20.83 17.14,17.65 18.67,17.65 21.59,14.73 21.59,2.29 22.48,1.4 23.5,1.4 29.34,7.24 29.34,99.06 25.02,103.38 C4.2 24.89,103.5 24.51,103.89 16.76,103.89 D2.2

### Text on the board
bPlace: -12V
bNames: 3.3V | SWDIO | SWCLK | GND